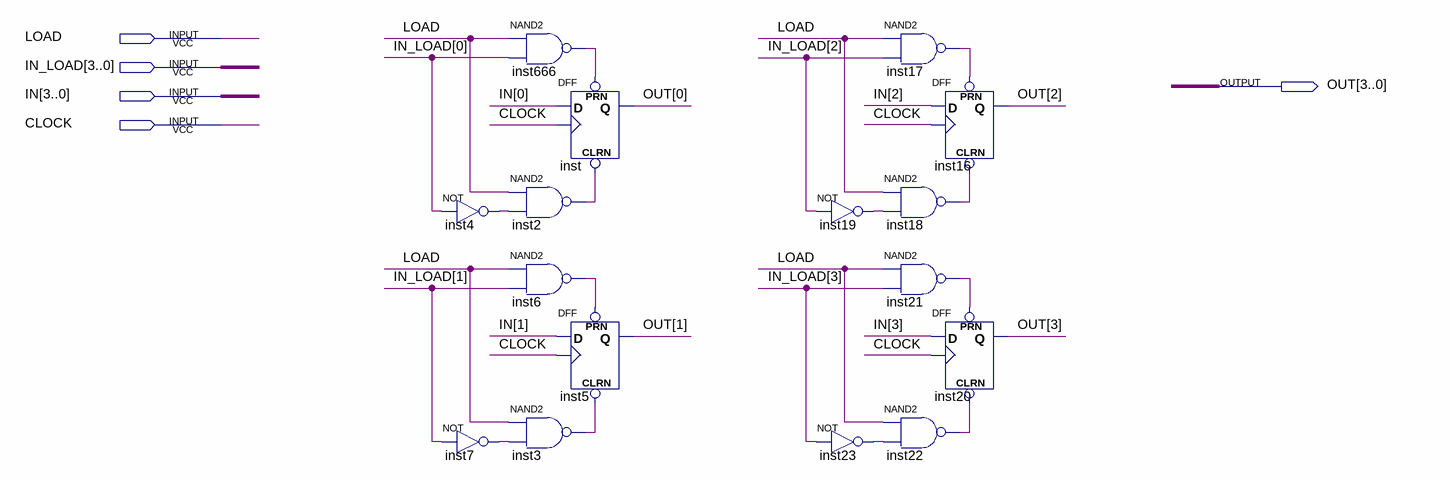
[diagram p0: schematic sheet]
// Quartus schematic REGISTER4bit.bdf as structural Verilog: 16 symbols, 5 pins
module REGISTER4bit (
  input  LOAD,
  input  [3:0] IN_LOAD,
  input  [3:0] IN,
  input  CLOCK,
  output [3:0] OUT
);

  wire inst2_out, inst3_out, inst4_out, inst6_out, inst7_out, inst17_out, inst18_out, inst19_out, inst21_out,
       inst22_out, inst23_out, inst666_out;

  not inst4 (inst4_out, IN_LOAD[0]);
  not inst7 (inst7_out, IN_LOAD[1]);
  nand inst666 (inst666_out, LOAD, IN_LOAD[0]);
  DFF inst (.CLRN(inst2_out), .CLK(CLOCK), .D(IN[0]), .PRN(inst666_out), .Q(OUT[0]));
  nand inst2 (inst2_out, LOAD, inst4_out);
  nand inst6 (inst6_out, LOAD, IN_LOAD[1]);
  DFF inst5 (.CLRN(inst3_out), .CLK(CLOCK), .D(IN[1]), .PRN(inst6_out), .Q(OUT[1]));
  nand inst3 (inst3_out, LOAD, inst7_out);
  nand inst17 (inst17_out, LOAD, IN_LOAD[2]);
  nand inst18 (inst18_out, LOAD, inst19_out);
  not inst19 (inst19_out, IN_LOAD[2]);
  nand inst21 (inst21_out, LOAD, IN_LOAD[3]);
  nand inst22 (inst22_out, LOAD, inst23_out);
  not inst23 (inst23_out, IN_LOAD[3]);
  DFF inst16 (.CLRN(inst18_out), .CLK(CLOCK), .D(IN[2]), .PRN(inst17_out), .Q(OUT[2]));
  DFF inst20 (.CLRN(inst22_out), .CLK(CLOCK), .D(IN[3]), .PRN(inst21_out), .Q(OUT[3]));
endmodule
